# EAGLE design SHABlindController (EAGLE 6.5.0)
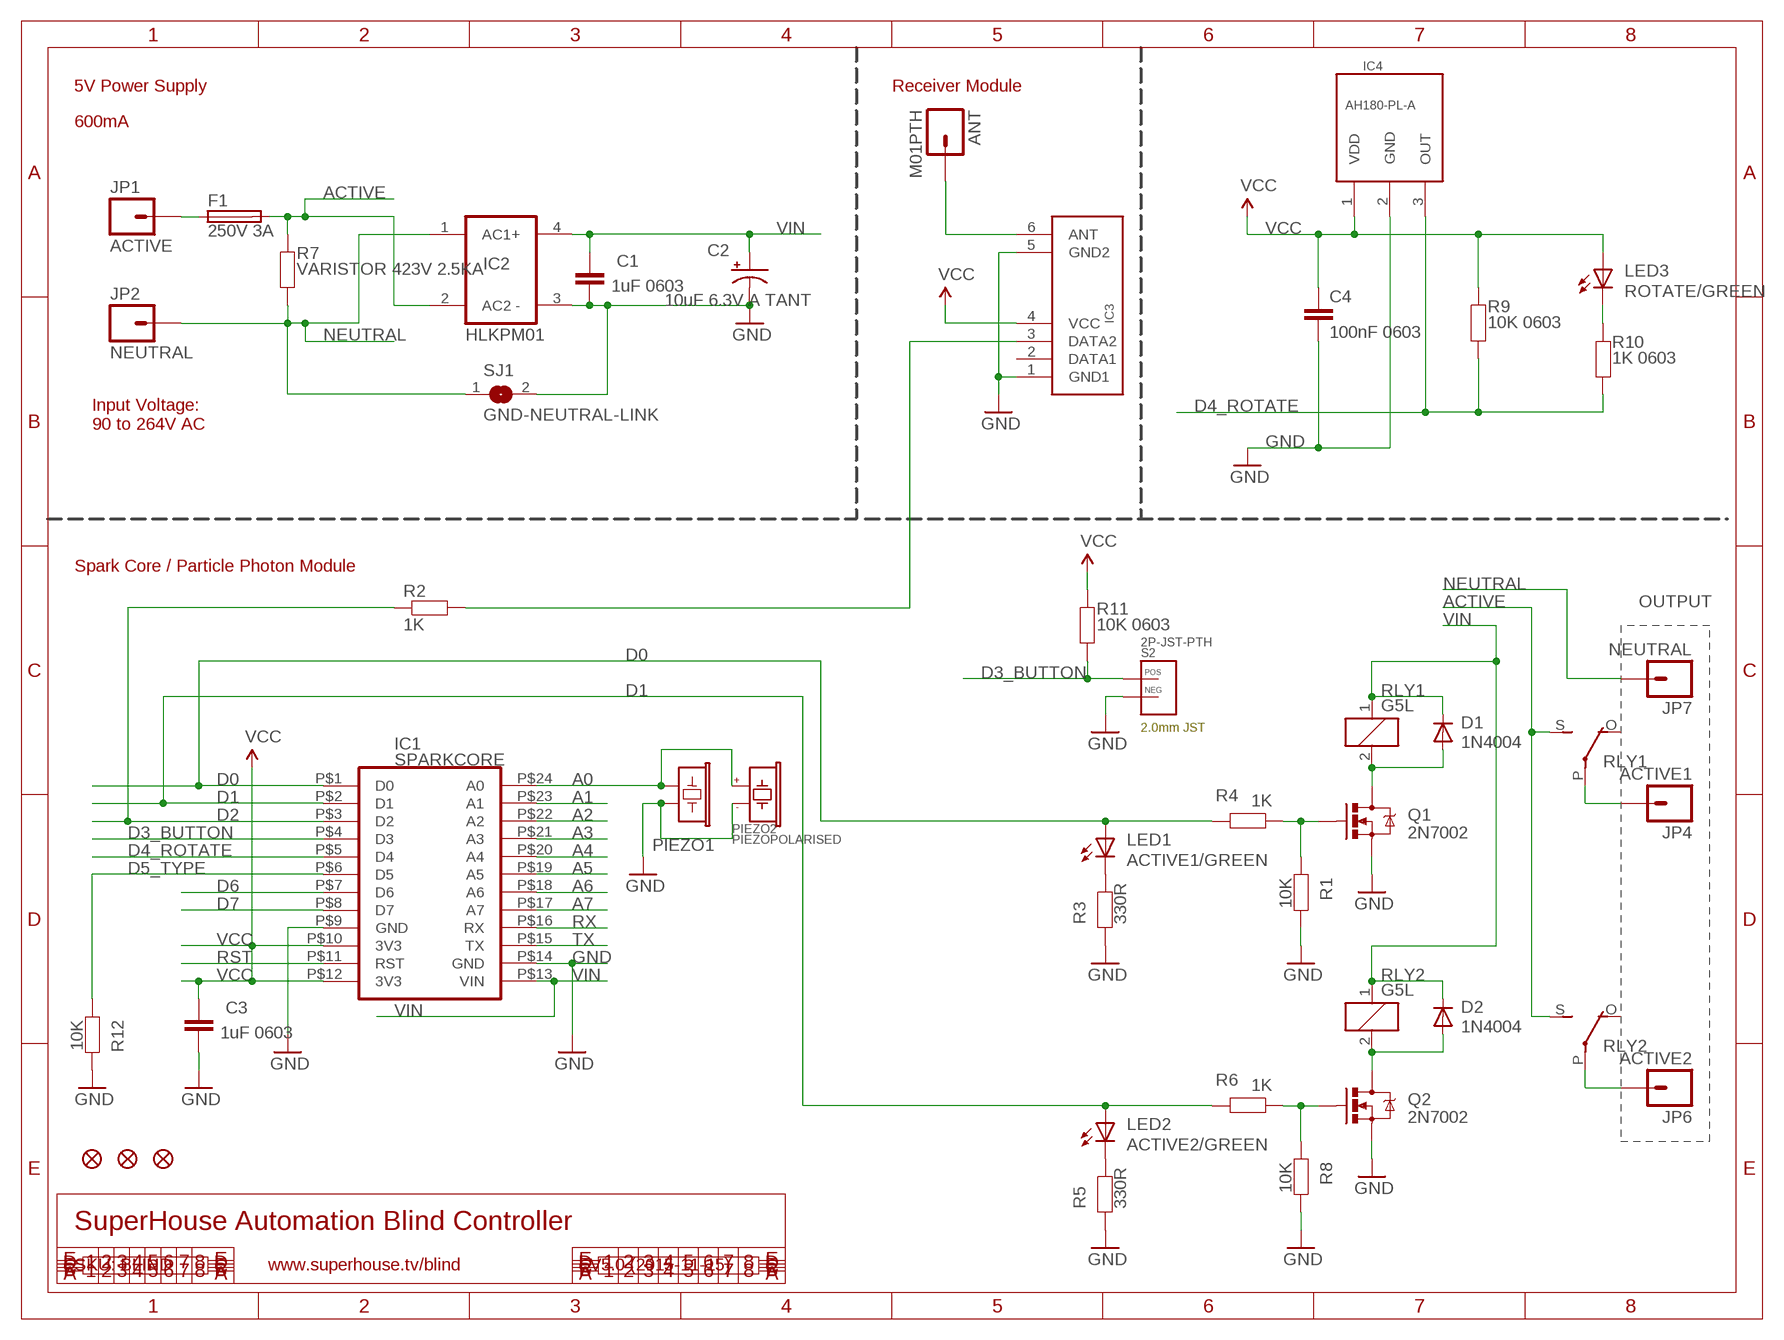
[diagram p0: schematic, sheet 1]

## Parts
ANT  M01PTH  [1X01]
C1  1uF 0603  CAP0603  [0603@1]
C2  10uF 6.3V A TANT  CAP_POL1206  [EIA3216]
C3  1uF 0603  CAP0603  [0603@1]
C4  100nF 0603  CAP0603  [0603]
D1  1N4004  DIODESMB  [SMB-DIODE]
D2  1N4004  DIODESMB  [SMB-DIODE]
F1  250V 3A  PICOFUSEH  [PICOFUSE]
FID1  FIDUCIAL1X2.5  [FIDUCIAL-1X2.5]
FID2  FIDUCIAL1X2.5  [FIDUCIAL-1X2.5]
FID3  FIDUCIAL1X2.5  [FIDUCIAL-1X2.5]
IC1  SPARKCORE  [SPARKCORE]
IC2  HLKPM01  [HLKPM01]
IC3  RXB1  RXB1SHORTFLAT  [RX-B1-SHORT-FLAT]
IC4  AH180-PL-A  US1881TO92  [TO92FLATUP]
JP1  ACTIVE  M01PTH_LARGE  [1X01LARGE]
JP2  NEUTRAL  M01PTH_LARGE  [1X01LARGE]
JP4  ACTIVE1  M01PTH_LARGE  [1X01LARGE]
JP6  ACTIVE2  M01PTH_LARGE  [1X01LARGE]
JP7  NEUTRAL  M01PTH_LARGE  [1X01LARGE]
LED1  ACTIVE1/GREEN  LED0603  [LED-0603]
LED2  ACTIVE2/GREEN  LED0603  [LED-0603]
LED3  ROTATE/GREEN  LED0603  [LED-0603]
PIEZO1  BUZZERSMD12X12  [BUZZER-12X12-SMT]
PIEZO2  PIEZOPOLARISED  [PIEZO12MMWIDEPOLARISED]
Q1  2N7002  MOSFET-NCHANNELSMD  [SOT23-3]
Q2  2N7002  MOSFET-NCHANNELSMD  [SOT23-3]
R1  10K  RESISTOR0603  [0603]
R2  1K  RESISTOR0603  [0603]
R3  330R  RESISTOR0603  [0603]
R4  1K  RESISTOR0603  [0603]
R5  330R  RESISTOR0603  [0603]
R6  1K  RESISTOR0603  [0603]
R7  VARISTOR 423V 2.5KA  RESISTORPTH1  [AXIAL-0.3]
R8  10K  RESISTOR0603  [0603]
R9  10K 0603  RESISTOR0603  [0603]
R10  1K 0603  RESISTOR0603  [0603]
R11  10K 0603  RESISTOR0603  [0603]
R12  10K  RESISTOR0603  [0603]
RLY1  G5L  [G5LE]
RLY2  G5L  [G5LE]
S2  2P-JST-PTH  2P-JST-TH-RAPTH  [JST-2MM-TH-RA]
SJ1  GND-NEUTRAL-LINK  SJ  [SJ]

## Nets
A0: IC1.P$24(A0) PIEZO1.1 PIEZO2.1(+)
A1: IC1.P$23(A1)
A2: IC1.P$22(A2)
A3: IC1.P$21(A3)
A4: IC1.P$20(A4)
A5: IC1.P$19(A5)
A6: IC1.P$18(A6)
A7: IC1.P$17(A7)
ACTIVE: F1.2 IC2.2(AC2) R7.P$2 RLY1.S(2:S) RLY2.S(2:S)
D0: IC1.P$1(D0) LED1.A R4.2
D1: IC1.P$2(D1) LED2.A R6.2
D2: IC1.P$3(D2) R2.1
D3_BUTTON: IC1.P$4(D3) R11.1 S2.POS
D4_ROTATE: IC1.P$5(D4) IC4.3(OUT) R9.1 R10.2
D5_TYPE: IC1.P$6(D5) R12.1
D6: IC1.P$7(D6)
D7: IC1.P$8(D7)
GND: C1.2 C2.C(-) C3.2 C4.2 IC1.P$9(GND) IC1.P$14(GND) IC2.3(-) IC3.1(GND1) IC3.5(GND2) IC4.2(GND) PIEZO1.2 PIEZO2.2(-) Q1.2(S) Q2.2(S) R1.2 R3.1 R5.1 R8.2 R12.2 S2.NEG SJ1.2
N$1: ANT.1 IC3.6(ANT)
N$2: LED2.C R5.2
N$3: D2.A Q2.3(D) RLY2.2
N$4: D1.A Q1.3(D) RLY1.2
N$5: Q1.1(G) R1.1 R4.1
N$6: Q2.1(G) R6.1 R8.1
N$9: F1.1 JP1.1
N$11: LED3.C R10.1
N$14: JP4.1 RLY1.P(2:P)
N$17: JP6.1 RLY2.P(2:P)
N$25: LED1.C R3.2
N$135: IC3.3(DATA2) R2.2
NEUTRAL: IC2.1(AC1) JP2.1 JP7.1 R7.P$1 SJ1.1
RST: IC1.P$11(RST)
RX: IC1.P$16(RX)
TX: IC1.P$15(TX)
VCC [VCC]: C3.1 C4.1 IC1.P$10(3V3) IC1.P$12(3V3) IC3.4(VCC) IC4.1(VDD) LED3.A R9.2 R11.2
VIN: C1.1 C2.A(+) D1.C D2.C IC1.P$13(VIN) IC2.4(+) RLY1.1 RLY2.1
Unconnected: IC3.2(DATA1) RLY1.O(2:O) RLY2.O(2:O)

## Notes on the sheet
- 5V Power Supply | Receiver Module
- 600mA
- Input Voltage:
  90 to 264V AC
- Spark Core / Particle Photon Module
- OUTPUT
- 2.0mm JST
- SuperHouse Automation Blind Controller
- SKU: BLIND | www.superhouse.tv/blind | V5.0 (2015-11-15)

## Library data of the parts
ANT = freetronics:M01: Header 1 Standard 1-pin 0.1" header. Use with straight break away headers (SKU : PRT-00116), right angle break away headers (PRT-00553), swiss pins (PRT-00743), machine pins (PRT-00117), and female headers (PRT-00115).
C1 C3 = freetronics:CAP: Capacitor Standard 0603 ceramic capacitor, and 0.1" leaded capacitor.
C2 = freetronics:CAP_POL: Capacitor Polarized These are standard SMD and PTH capacitors. Normally 10uF, 47uF, and 100uF in electrolytic and tantalum varieties. Always verify the external diameter of the through hole cap, it varies with capacity, voltage, and manufacturer. The EIA devices should be standard.
C4 = freetronics-master-v1.1:CAP: Capacitor Standard 0603 ceramic capacitor, and 0.1" leaded capacitor.
D1 D2 = freetronics-master-v1.1:DIODE: Diode These are standard reverse protection diodes and small signal diodes. SMA package can handle up to about 1A. SOD-323 can handle about 200mA. What the SOD-323 package when ordering, there are some mfgs out there that are 5-pin packages.
F1 = freetronics-jon:PICOFUSE: PICOFUSE 19275, Wickmann; OC_FARNELL: unknown; OC_NEWARK: unknown
FID1-FID3 = freetronics:FIDUCIAL: Fiducial Alignment Points Various fiducial points for machine vision alignment.
IC1 = freetronics-jon:SPARKCORE
IC2 = freetronics-jon:HLKPM01
IC3 = freetronics-master-v1:RXB1SHORT
IC4 = freetronics-jon:US1881
JP1 JP2 JP4 JP6 JP7 = freetronics-master-v1.1:M01: Header 1 Standard 1-pin 0.1" header. Use with straight break away headers (SKU : PRT-00116), right angle break away headers (PRT-00553), swiss pins (PRT-00743), machine pins (PRT-00117), and female headers (PRT-00115).
LED1-LED3 = freetronics:LED: LEDs Standard schematic elements and footprints for 5mm, 3mm, 1206, and 0603 sized LEDs. 5mm - Spark Fun Electronics SKU : COM-00529 (and others)
PIEZO1 = freetronics-master-v1:BUZZER: Buzzer - Piezo Transducer
PIEZO2 = freetronics-jon:PIEZOPOLARISED
Q1 Q2 = freetronics-master-v1:MOSFET-NCHANNEL
R1-R6 R8 R12 = freetronics:RESISTOR: Resistor Basic schematic elements and footprints for 0603, 1206, and PTH 1/10th watt (small) resistors.
R7 = freetronics-master-v1.1:RESISTOR: Resistor Basic schematic elements and footprints for 0603, 1206, and PTH 1/10th watt (small) resistors.
R9-R11 = freetronics-master-v1:RESISTOR: Resistor Basic schematic elements and footprints for 0603, 1206, and PTH 1/10th watt (small) resistors.
RLY1 RLY2 = relay:G5L: RELAY 1 x switch, 10 A/120 V AC, 8 A/30 V ADC, Omron; OC_FARNELL: unknown; OC_NEWARK: unknown
S2 = freetronics-jon:2P-JST-TH-RA: 2.0 mm pitch, through-hole 2-pin right-angle JST header, suitable for small Li-po batteries.
SJ1 = freetronics-master-v1.1:SJ: SMD solder JUMPER

## Net classes
0 Default: width 0.203 mm
1 VCC: width 0.305 mm

## Board
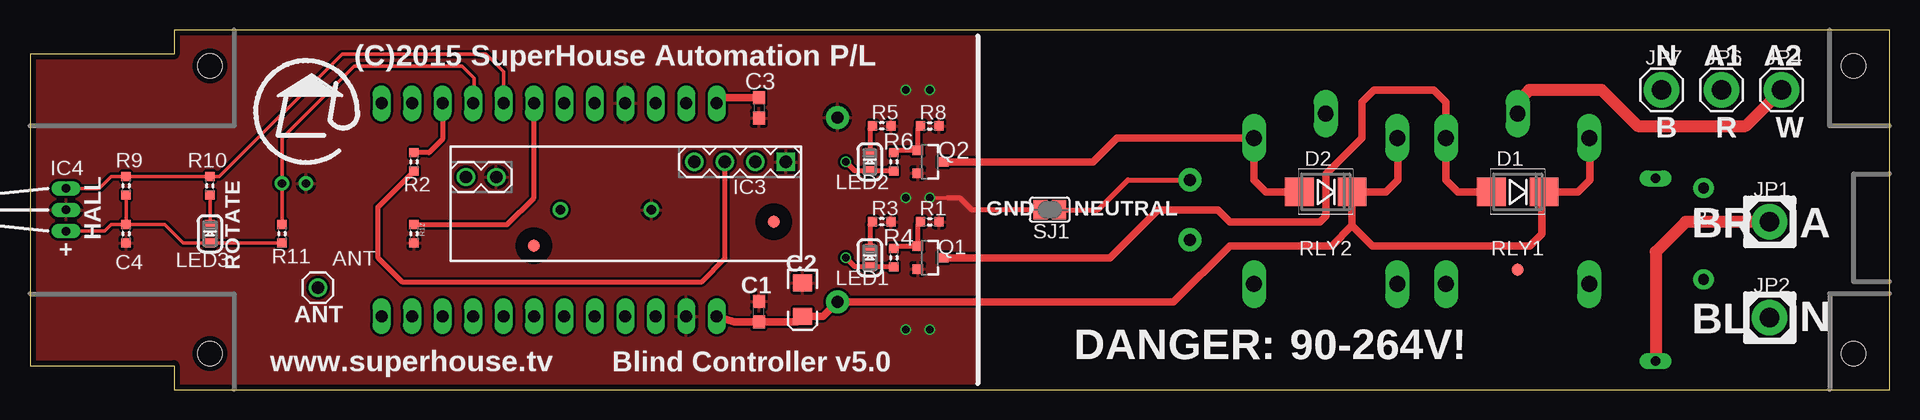
[diagram p1: board, top side]
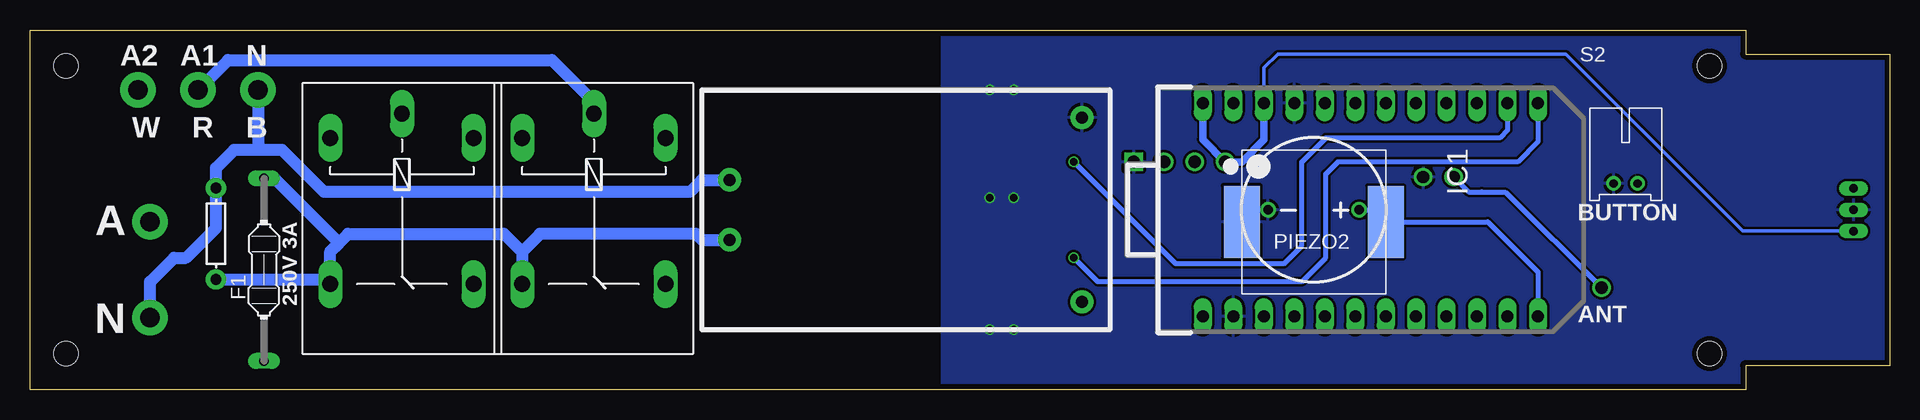
[diagram p2: board, bottom side, seen from below]

Size 155 x 30 mm. Coordinates in mm from the lower left corner, seen from the top.
Outline: 12,0 155,0 155,30 12,30 12,28 0,28 0,2 12,2 12,0
Copper layers (1*16): Top 0.035mm / dielectric 1.5mm / Bottom 0.035mm
Design rules "default": minimum track width 8mil, minimum drill 15mil, track to track 8mil, track to pad 8mil, pad to pad 8mil, via to via 8mil, smd to smd 8mil, copper to edge 18mil, drill to drill 8mil, minimum pad ring 10mil, minimum via ring 6mil, stop-mask expansion 4mil, vias tented up to drill 25mil, thermal gap 10mil
Holes 2 mm at 152,27 152,3 15,3 15,27
tRestrict: area 123,9 to 125,11; area 41,11 to 43,13; area 61,13 to 63,15

### Footprints (pad centres in the part's own frame; a part is rotated, then mirrored left to right if it is on the bottom)
1X01 = drill 1.016: 1 0,0
0603@1 = smd 1.1 x 1: 1 -0.85,0; 2 0.85,0
EIA3216 = smd 1.4 x 1.6: A 1.4,0; C -1.4,0
0603 = smd 0.762 x 0.762: 1 -0.762,0; 2 0.762,0
SMB-DIODE = smd 2.4 x 2.4: A 2.2,0; C -2.2,0
PICOFUSE = drill 0.813 long: 1 -7.62,0; 2 7.62,0
FIDUCIAL-1X2.5 = smd 1 x 1: 1 0,0
SPARKCORE = drill 1 long: P$1 -8.89,12.7; P$2 -8.89,10.16; P$3 -8.89,7.62; P$4 -8.89,5.08; P$5 -8.89,2.54; P$6 -8.89,0; P$7 -8.89,-2.54; P$8 -8.89,-5.08; P$9 -8.89,-7.62; P$10 -8.89,-10.16; P$11 -8.89,-12.7; P$12 -8.89,-15.24; P$13 8.89,-15.24; P$14 8.89,-12.7; P$15 8.89,-10.16; P$16 8.89,-7.62; P$17 8.89,-5.08; P$18 8.89,-2.54; P$19 8.89,0; P$20 8.89,2.54; P$21 8.89,5.08; P$22 8.89,7.62; P$23 8.89,10.16; P$24 8.89,12.7
HLKPM01 = drill 1 pad 1.93: 1 -14.7,2.5; 2 -14.7,-2.5; 3 14.7,7.7; 4 14.7,-7.7
RX-B1-SHORT-FLAT = drill 1.016 square: 1 0,0 | drill 1.016: 2 2.54,0; 3 5.08,0; 4 7.62,0; 5 24.13,1.27; 6 26.67,1.27
TO92FLATUP = drill 0.7 long: 1 -1.778,0; 2 0,0; 3 1.778,0
1X01LARGE = drill 1.6 pad 2.921: 1 0,0
LED-0603 = smd 0.8 x 0.8: A 0,-0.75; C 0,0.75
BUZZER-12X12-SMT = smd 3 x 6: 1 -6,0; 2 6,0
PIEZO12MMWIDEPOLARISED = drill 0.8: 1 -3.8,0; 2 3.8,0
SOT23-3 = smd 0.8 x 0.9: 1 -0.95,-1; 2 0.95,-1; 3 0,1.1
AXIAL-0.3 = drill 0.9 pad 1.676: P$1 -3.81,0; P$2 3.81,0
G5LE = drill 1.321 long: 1 -7.493,-5.969; 2 -7.493,5.969; O 4.699,5.969; P -9.525,0; S 4.699,-5.969
JST-2MM-TH-RA = drill 0.7: NEG -1,-3.81; POS 1,-3.81
SJ = smd 1.168 x 1.6: 1 -0.762,0; 2 0.762,0

### Placement (x,y rotation side)
ANT  24,8.5 0 top
C1  60.76,6.5 90 top
C2  64.41,7.5 270 top
C3  60.76,23.5 270 top
C4  8,13 270 top
D1  124,16.5 180 top
D2  108,16.5 180 top
F1  135.5,10 90 bottom
FID1  124,10 0 top
FID2  42,12 0 top
FID3  62,14 0 top
IC1  42,15 270 bottom
IC2  82,15 0 bottom
IC3  63,19 180 top
IC4  3,15 90 top
JP1  145,14 0 top
JP2  145,6 0 top
JP4  146,25 0 top
JP6  141,25 0 top
JP7  136,25 0 top
LED1  70,11 0 top
LED2  70,19 0 top
LED3  15,13 0 top
PIEZO1  48,14 180 bottom
PIEZO2  48,15 180 bottom
Q1  75,11 270 top
Q2  75,19 270 top
R1  75,14 0 top
R2  32,19 270 top
R3  71,14 180 top
R4  72,11 270 top
R5  71,22 180 top
R6  72,19 270 top
R7  139.5,13 270 bottom
R8  75,22 0 top
R9  8,17 270 top
R10  15,17 90 top
R11  21,13 270 top
R12  32,13 270 top
RLY1  124,13.5 270 bottom
RLY2  108,13.5 270 bottom
S2  22,21 0 bottom
SJ1  85,15 180 top

### Tracks (layer width: path | path; a pad name or v marks a point on that pad's centre or on a via)
A0
  Bottom 0.406: IC1.P$24 29.3,9.8 33.5,14 PIEZO1.1 42.5,15 PIEZO2.1
ACTIVE
  Bottom 1.016: 114,11.5 112.5,13 99.5,13 99,12.5 IC2.2 | 114,11.5 114,9.33 RLY2.S | 129.25,12.25 129.97,11.53 RLY1.S 129.97,9.19 R7.P$2 | 129.25,12.25 128.5,13 115.5,13 114,11.5 | F1.2 134.62,17.62 129.25,12.25
D0  (via drill 0.6)
  Top 0.406: R4.2 70.01,10.24 LED1.A 68.75,10.25 v68,11
  Bottom 0.406: IC1.P$1 29.3,20.7 31,19 46,19 47,18 47,11 49,9 66,9 v68,11
D1  (via drill 0.6)
  Top 0.406: R6.2 70.01,18.24 LED2.A 68.75,18.25 v68,19
  Bottom 0.406: IC1.P$2 31.84,21.66 32.5,21 47,21 49,19 49,12 50.5,10.5 59.5,10.5 v68,19
D2
  Top 0.406: IC1.P$3 34.38,20.88 33.26,19.76 R2.1
D3_BUTTON
  Top 0.305: R11.1 S2.POS 21,21 27,27 36,27 37,26 37,23.97 IC1.P$4
D4_ROTATE
  Top 0.305: IC1.P$5 39.46,26.54 38,28 26,28 15.76,17.76 R10.2 R9.1 6.76,17.76 5.78,16.78 IC4.3
D5_TYPE
  Top 0.406: R12.1 39.76,13.76 42,16 IC1.P$6
GND  (via drill 0.6)
  Top 0.305: 76.5,16 v75,16
  Top 0.406: SJ1.2 78.5,15 77.5,16 76.5,16
  other vias: 73,16 73,25 75,25 73,5 75,5
  pour Bottom: 12,30 78.96,30 78.96,0 12,0 12,2 0,2 0,28 12,28
  pour Top: 12,30 78.96,30 78.96,0 12,0 12,2 0,2 0,28 12,28
N$1
  Bottom 0.406: IC3.6 35.1,16.5 34,16.5 32.04,16.46 ANT.1
N$2
  Top 0.406: R5.2 70,21.76 LED2.C
N$3
  Top 0.61: 76,19 Q2.3 88.6,19 90.59,20.99 RLY2.2 102.03,17.47 103,16.5 D2.A
N$4
  Top 0.61: 76,11 Q1.3 90,11 94,15 99,15 100,14 107.5,14 108,14.5 108,18 111,21 111,24 112,25 117,25 118,24 118,21.02 RLY1.2 118.03,17.47 119,16.5 D1.A
N$5
  Top 0.406: R4.1 72.19,11.95 Q1.1 74,13.76 R1.1
N$6
  Top 0.406: R6.1 72.19,19.95 Q2.1 74,21.76 R8.1
N$9
  Top 1.016: JP1.1 138,14 135.5,11.5 F1.1
N$11
  Top 0.305: R10.1 LED3.C
N$14
  Top 1.016: RLY1.P 124,24.02 124.97,25 131,25 134,22 143,22 JP4.1
N$17
  Bottom 1.016: RLY2.P 108,24 111.5,27.5 138.5,27.5 JP6.1
N$25
  Top 0.406: R3.2 70,13.76 LED1.C
N$135
  Top 0.406: IC3.3 57.92,10.92 56,9 31,9 29,11 29,15.24 R2.2
NEUTRAL
  Top 0.406: SJ1.1 89,15 91.5,17.5 IC2.1
  Bottom 1.016: 136,20 134,20 130.5,16.5 100,16.5 99,17.5 IC2.1 | 136,20 138,20 139.5,18.5 R7.P$1 139.5,13.5 142,11 143,11 145,9 JP2.1 | JP7.1 136,20
VCC
  Top 0.305: R9.2 C4.1 | C4.1 6.76,13.76 6.22,13.22 IC4.1 | C4.1 11.24,13.76 12.76,12.24 14.99,12.24 LED3.A 20.99,12.25 R11.2
  Top 0.61: IC1.P$12 57.7,24.35 C3.1
  Bottom 0.305: 52.16,20.84 52.16,26.84 51,28 27,28 12.22,13.22 IC4.1
  Bottom 0.61: IC1.P$12 57.24,20.86 IC3.4 54,19 52.16,20.84 IC1.P$10
VIN
  Top 0.61: 110.2,13.7 108.5,12 100,12 95.3,7.3 IC2.4 66.1,6.1 C2.A 63.96,5.65 C1.1 58.7,5.65 IC1.P$13 | 110.2,13.7 D2.C 113,16.5 114,17.5 114,20.96 RLY2.1 | 110.2,13.7 111.9,12 125,12 126,13 126,16.8 D1.C 129,16.5 130,17.5 130,20.96 RLY1.1

### Text on the board
tPlace: (C)2015 SuperHouse Automation P/L | N | A1 | A2 | B | R | W | GND | NEUTRAL | BR | A | HALL | + | ROTATE | ANT | BL | N | www.superhouse.tv | Blind Controller v5.0 | DANGER: | 90-264V!
bPlace: N | A1 | A2 | B | R | W | A | BUTTON | 250V 3A | N | ANT